# Altium schematic sheet BeagleBoneHeader.SchDoc
size A3
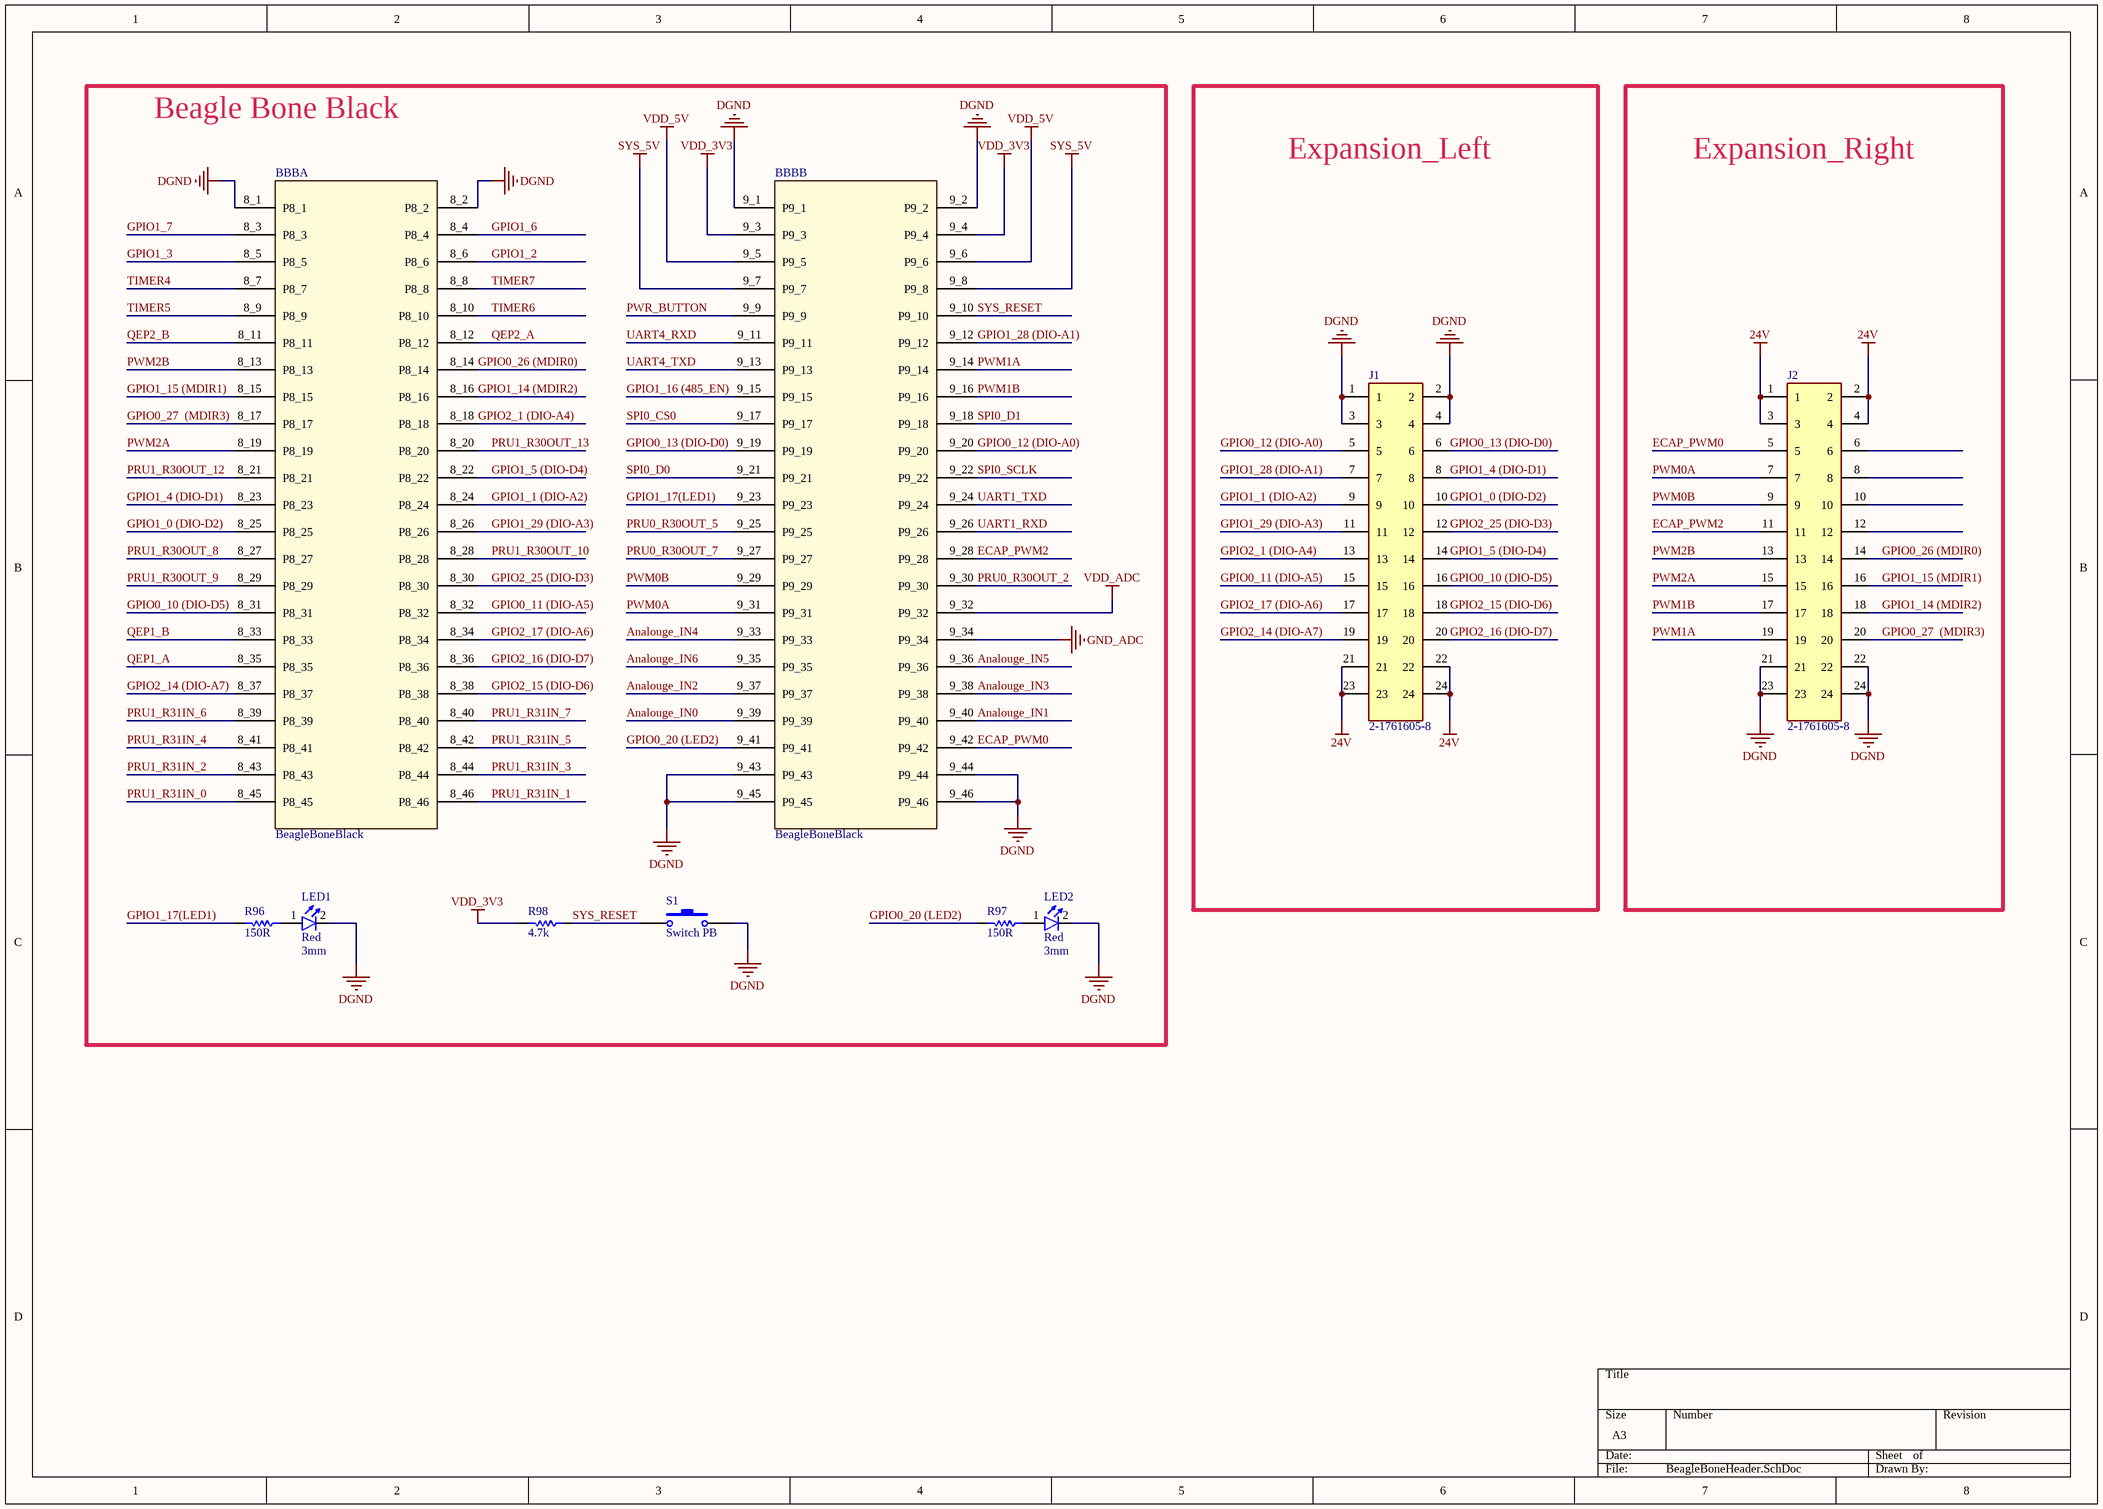
[diagram p0: BeagleBoneHeader.SchDoc]

## Parts
BBB  BeagleBoneBlack  [BeagleBoneBlack]  (parts A,B of 2)
J1  2-1761605-8  [TE_2-1761605-8]
J2  2-1761605-8  [TE_2-1761605-8]
LED1  Size: 3mm  [LED-3mm]  (hidden comment: Red)
LED2  Size: 3mm  [LED-3mm]  (hidden comment: Red)
R96  150R  [RES 0805 (2012X06L)]
R97  150R  [RES 0805 (2012X06L)]
R98  4.7k  [RES 0805 (2012X06L)]
S1  Switch PB  [Switch - Push to On]

## Blocks framed on the sheet
Beagle Bone Black: BBB LED1 LED2 R96-R98 S1
Expansion_Left: J1
Expansion_Right: J2

## Nets
24V: J1.21 J1.22 J1.23 J1.24 J2.1 J2.2 J2.3 J2.4
DGND: BBB.8_1(P8_1) BBB.8_2(P8_2) BBB.9_1(P9_1) BBB.9_2(P9_2) BBB.9_43(P9_43) BBB.9_44(P9_44) BBB.9_45(P9_45) BBB.9_46(P9_46) J1.1 J1.2 J1.3 J1.4 J2.21 J2.22 J2.23 J2.24 LED1.2(K) LED2.2(K) S1.2
GND_ADC: BBB.9_34(P9_34)
SYS_5V: BBB.9_7(P9_7) BBB.9_8(P9_8)
VDD_3V3: BBB.9_3(P9_3) BBB.9_4(P9_4) R98.2
VDD_5V: BBB.9_5(P9_5) BBB.9_6(P9_6)
VDD_ADC: BBB.9_32(P9_32)
Analouge_IN0: BBB.9_39(P9_39)
Analouge_IN1: BBB.9_40(P9_40)
Analouge_IN2: BBB.9_37(P9_37)
Analouge_IN3: BBB.9_38(P9_38)
Analouge_IN4: BBB.9_33(P9_33)
Analouge_IN5: BBB.9_36(P9_36)
Analouge_IN6: BBB.9_35(P9_35)
ECAP_PWM0: BBB.9_42(P9_42) J2.5
ECAP_PWM2: BBB.9_28(P9_28) J2.11
GPIO0_10 (DIO-D5): BBB.8_31(P8_31) J1.16
GPIO0_11 (DIO-A5): BBB.8_32(P8_32) J1.15
GPIO0_12 (DIO-A0): BBB.9_20(P9_20) J1.5
GPIO0_13 (DIO-D0): BBB.9_19(P9_19) J1.6
GPIO0_20 (LED2): BBB.9_41(P9_41) R97.2
GPIO0_26 (MDIR0): BBB.8_14(P8_14) J2.14
GPIO0_27  (MDIR3): BBB.8_17(P8_17) J2.20
GPIO1_0 (DIO-D2): BBB.8_25(P8_25) J1.10
GPIO1_1 (DIO-A2): BBB.8_24(P8_24) J1.9
GPIO1_2: BBB.8_6(P8_6)
GPIO1_3: BBB.8_5(P8_5)
GPIO1_4 (DIO-D1): BBB.8_23(P8_23) J1.8
GPIO1_5 (DIO-D4): BBB.8_22(P8_22) J1.14
GPIO1_6: BBB.8_4(P8_4)
GPIO1_7: BBB.8_3(P8_3)
GPIO1_14 (MDIR2): BBB.8_16(P8_16) J2.18
GPIO1_15 (MDIR1): BBB.8_15(P8_15) J2.16
GPIO1_16 (485_EN): BBB.9_15(P9_15)
GPIO1_17(LED1): BBB.9_23(P9_23) R96.2
GPIO1_28 (DIO-A1): BBB.9_12(P9_12) J1.7
GPIO1_29 (DIO-A3): BBB.8_26(P8_26) J1.11
GPIO2_1 (DIO-A4): BBB.8_18(P8_18) J1.13
GPIO2_14 (DIO-A7): BBB.8_37(P8_37) J1.19
GPIO2_15 (DIO-D6): BBB.8_38(P8_38) J1.18
GPIO2_16 (DIO-D7): BBB.8_36(P8_36) J1.20
GPIO2_17 (DIO-A6): BBB.8_34(P8_34) J1.17
GPIO2_25 (DIO-D3): BBB.8_30(P8_30) J1.12
PRU0_R30OUT_2: BBB.9_30(P9_30)
PRU0_R30OUT_5: BBB.9_25(P9_25)
PRU0_R30OUT_7: BBB.9_27(P9_27)
PRU1_R30OUT_8: BBB.8_27(P8_27)
PRU1_R30OUT_9: BBB.8_29(P8_29)
PRU1_R30OUT_10: BBB.8_28(P8_28)
PRU1_R30OUT_12: BBB.8_21(P8_21)
PRU1_R30OUT_13: BBB.8_20(P8_20)
PRU1_R31IN_0: BBB.8_45(P8_45)
PRU1_R31IN_1: BBB.8_46(P8_46)
PRU1_R31IN_2: BBB.8_43(P8_43)
PRU1_R31IN_3: BBB.8_44(P8_44)
PRU1_R31IN_4: BBB.8_41(P8_41)
PRU1_R31IN_5: BBB.8_42(P8_42)
PRU1_R31IN_6: BBB.8_39(P8_39)
PRU1_R31IN_7: BBB.8_40(P8_40)
PWM0A: BBB.9_31(P9_31) J2.7
PWM0B: BBB.9_29(P9_29) J2.9
PWM1A: BBB.9_14(P9_14) J2.19
PWM1B: BBB.9_16(P9_16) J2.17
PWM2A: BBB.8_19(P8_19) J2.15
PWM2B: BBB.8_13(P8_13) J2.13
PWR_BUTTON: BBB.9_9(P9_9)
QEP1_A: BBB.8_35(P8_35)
QEP1_B: BBB.8_33(P8_33)
QEP2_A: BBB.8_12(P8_12)
QEP2_B: BBB.8_11(P8_11)
SPI0_CS0: BBB.9_17(P9_17)
SPI0_D0: BBB.9_21(P9_21)
SPI0_D1: BBB.9_18(P9_18)
SPI0_SCLK: BBB.9_22(P9_22)
SYS_RESET: BBB.9_10(P9_10) R98.1 S1.1
TIMER4: BBB.8_7(P8_7)
TIMER5: BBB.8_9(P8_9)
TIMER6: BBB.8_10(P8_10)
TIMER7: BBB.8_8(P8_8)
UART1_RXD: BBB.9_26(P9_26)
UART1_TXD: BBB.9_24(P9_24)
UART4_RXD: BBB.9_11(P9_11)
UART4_TXD: BBB.9_13(P9_13)
NetLED1_1: LED1.1(A) R96.1
NetLED2_1: LED2.1(A) R97.1

Not connected (* = marked no-connect by the designer): J2 6 8 10 12

## Library data of the parts
J1 J2 = 2-1761605-8: IDC LOW PRO HDR 64P RA BLUE; Package: None; Price: None; Value: *; MP: 2-1761605-8; Availability: Unavailable
LED1 LED2 = LED: Designer: Saeid Jorablo; Organazation: ControTec; Adding Date: 1387/12/22; Color: Red
R96-R98 = Resistor: Tolerance: 5%; Power: 1/8 W
  R96 R97: Value: 150R
  R98: Value: 4.7k
S1 = Switch PB: Push Button Switch